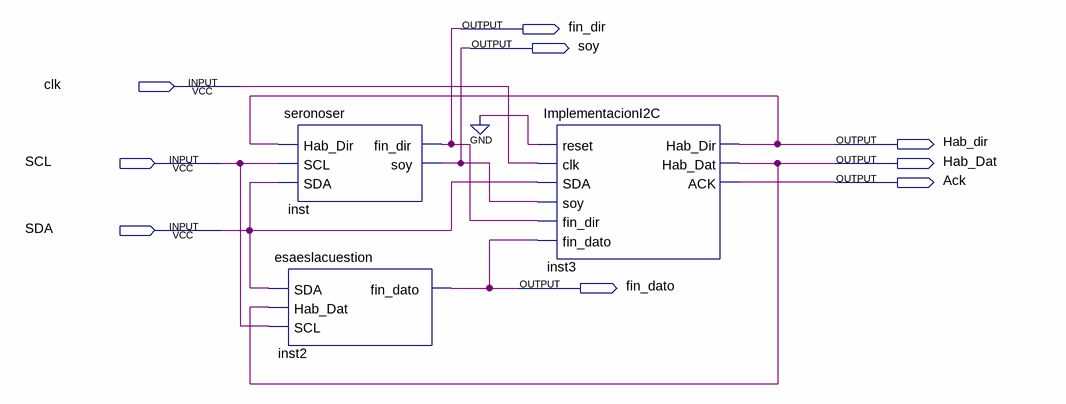
[diagram p0: schematic sheet]
// Quartus schematic Esquematico.bdf as structural Verilog: 3 symbols, 9 pins
module Esquematico (
  input  clk,
  input  SCL,
  input  SDA,
  output fin_dir,
  output soy,
  output Hab_dir,
  output Hab_Dat,
  output Ack,
  output fin_dato
);

  seronoser inst (.Hab_Dir(Hab_dir), .SCL(SCL), .SDA(SDA), .fin_dir(fin_dir), .soy(soy));
  esaeslacuestion inst2 (.SDA(SDA), .Hab_Dat(Hab_Dat), .SCL(SCL), .fin_dato(fin_dato));
  ImplementacionI2C inst3 (
    .SDA(SDA), .clk(clk), .fin_dato(fin_dato), .fin_dir(fin_dir), .reset(1'b0), .soy(soy), .ACK(Ack),
    .Hab_Dat(Hab_Dat), .Hab_Dir(Hab_dir));
endmodule
